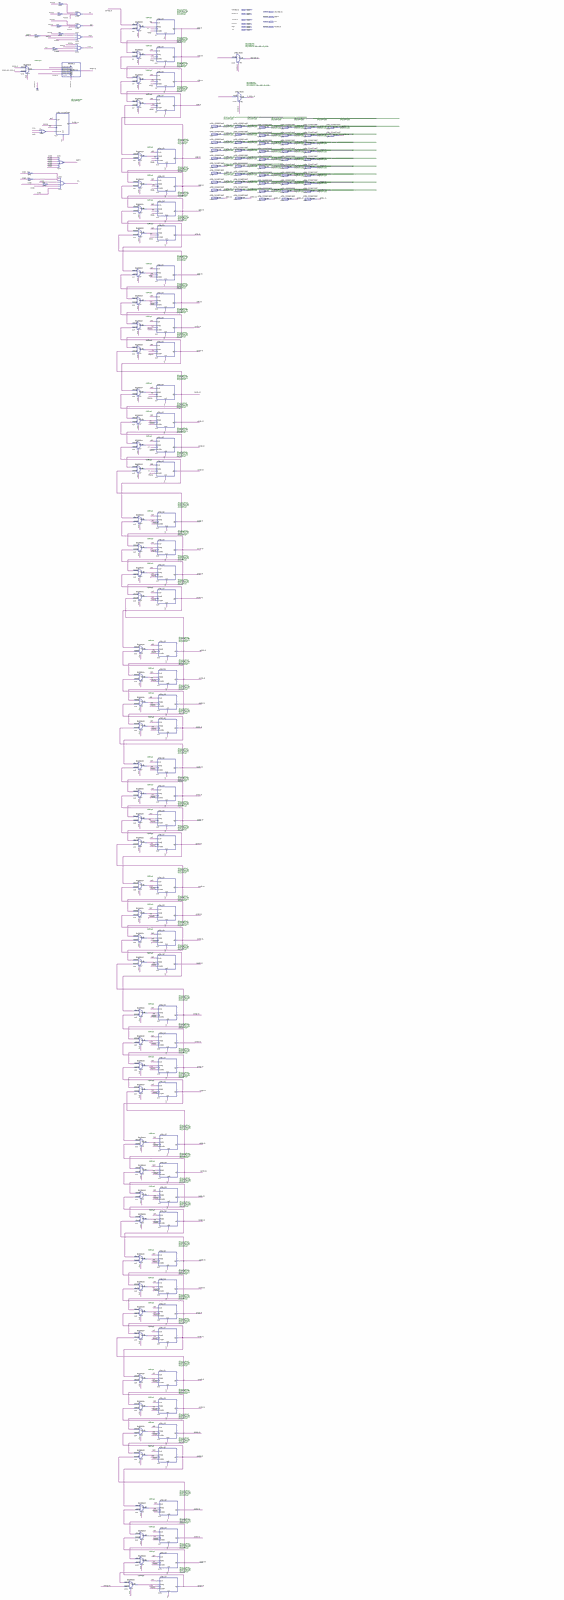
[diagram p0: schematic sheet, whole]
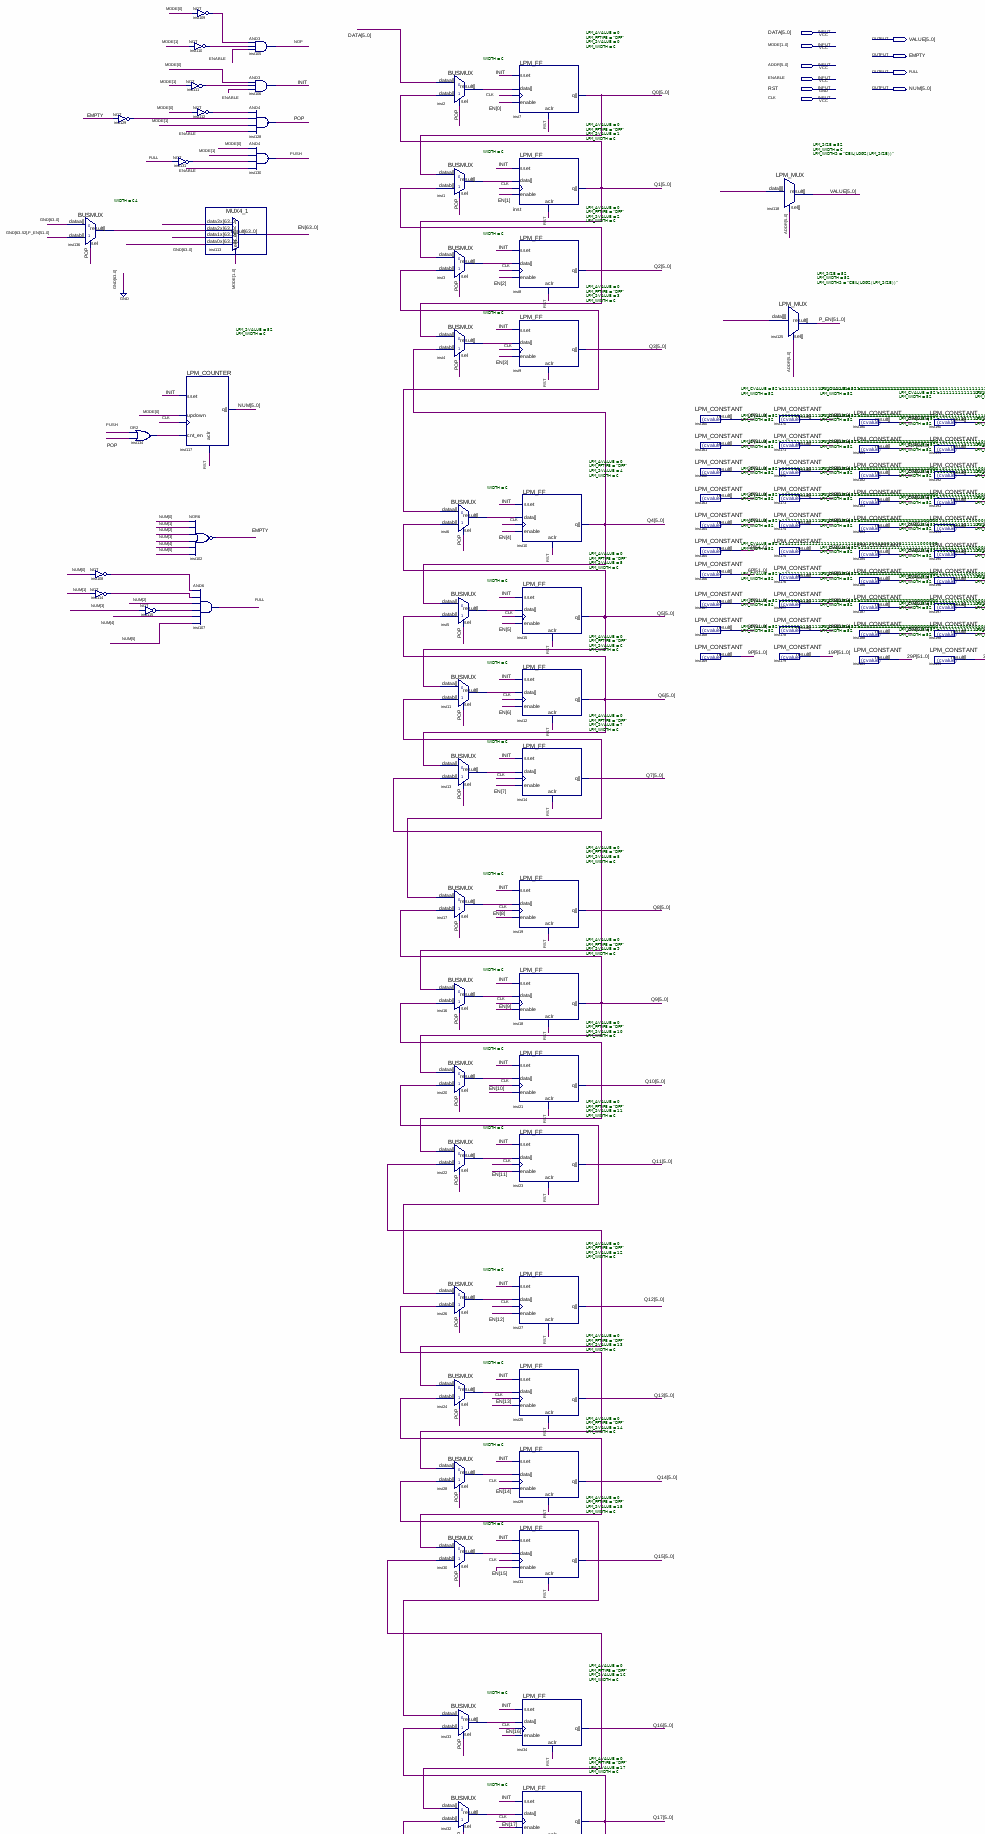
[diagram p1: schematic sheet, upper left part]
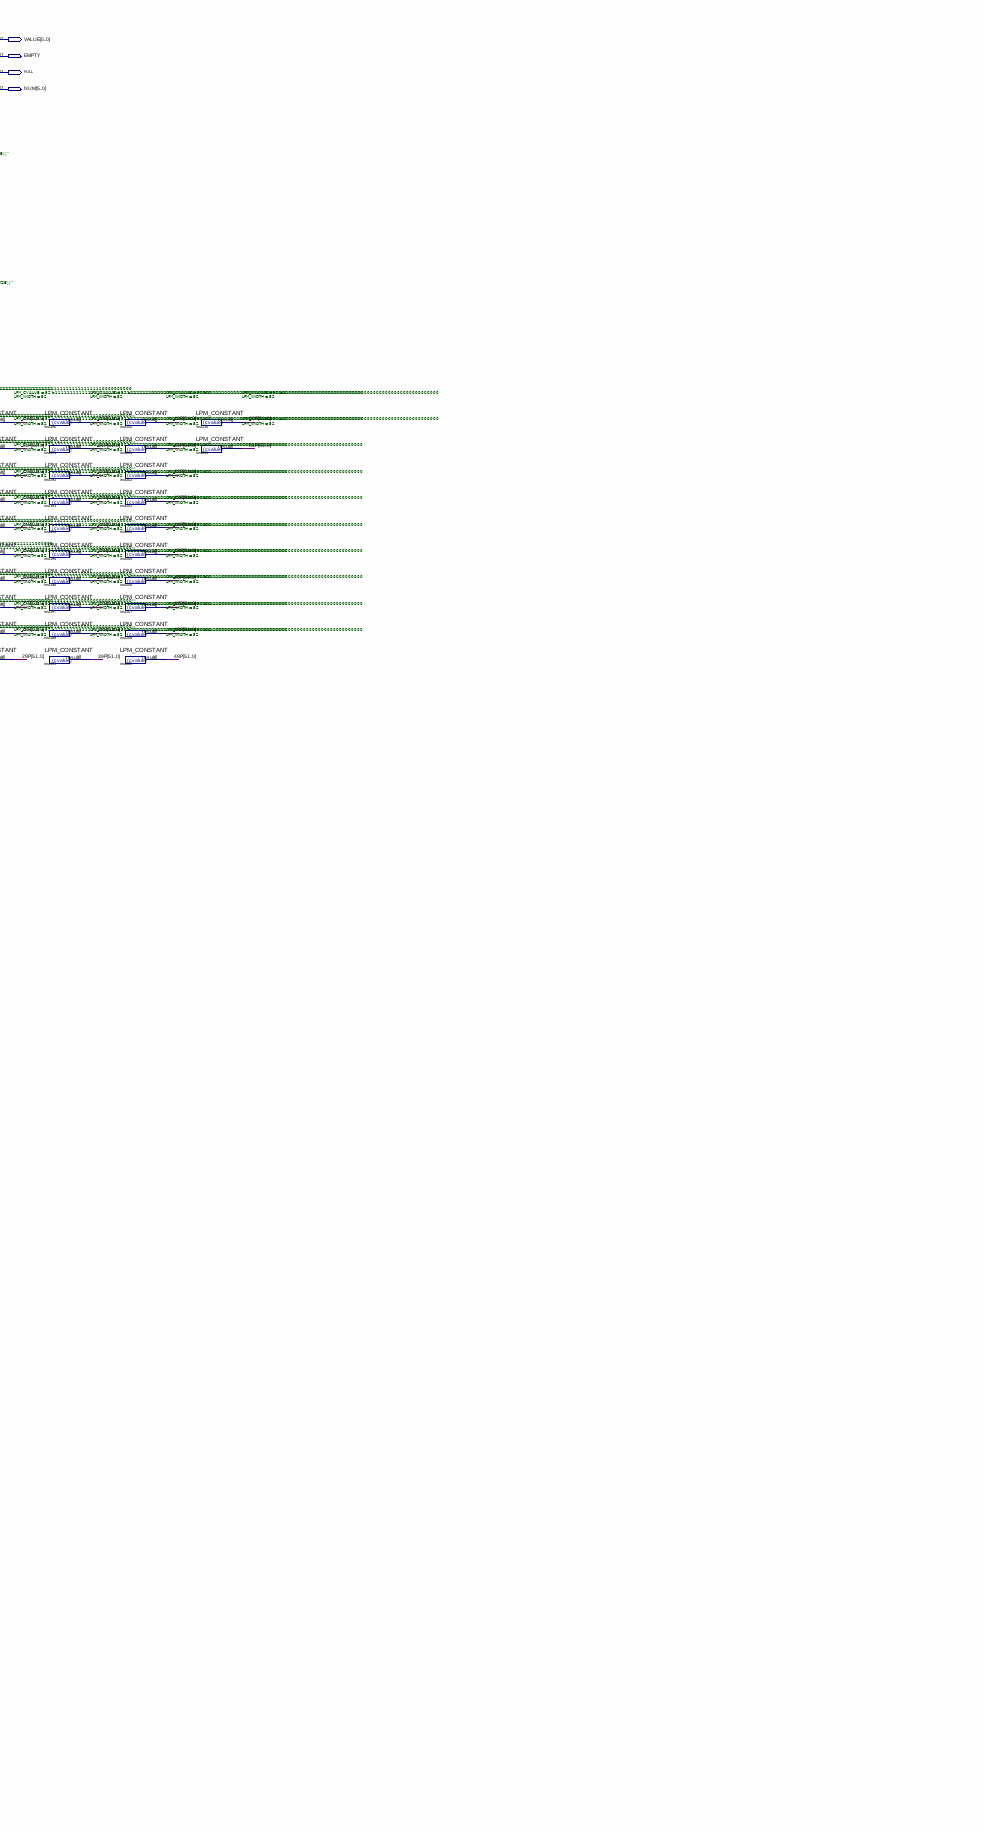
[diagram p2: schematic sheet, upper right part]
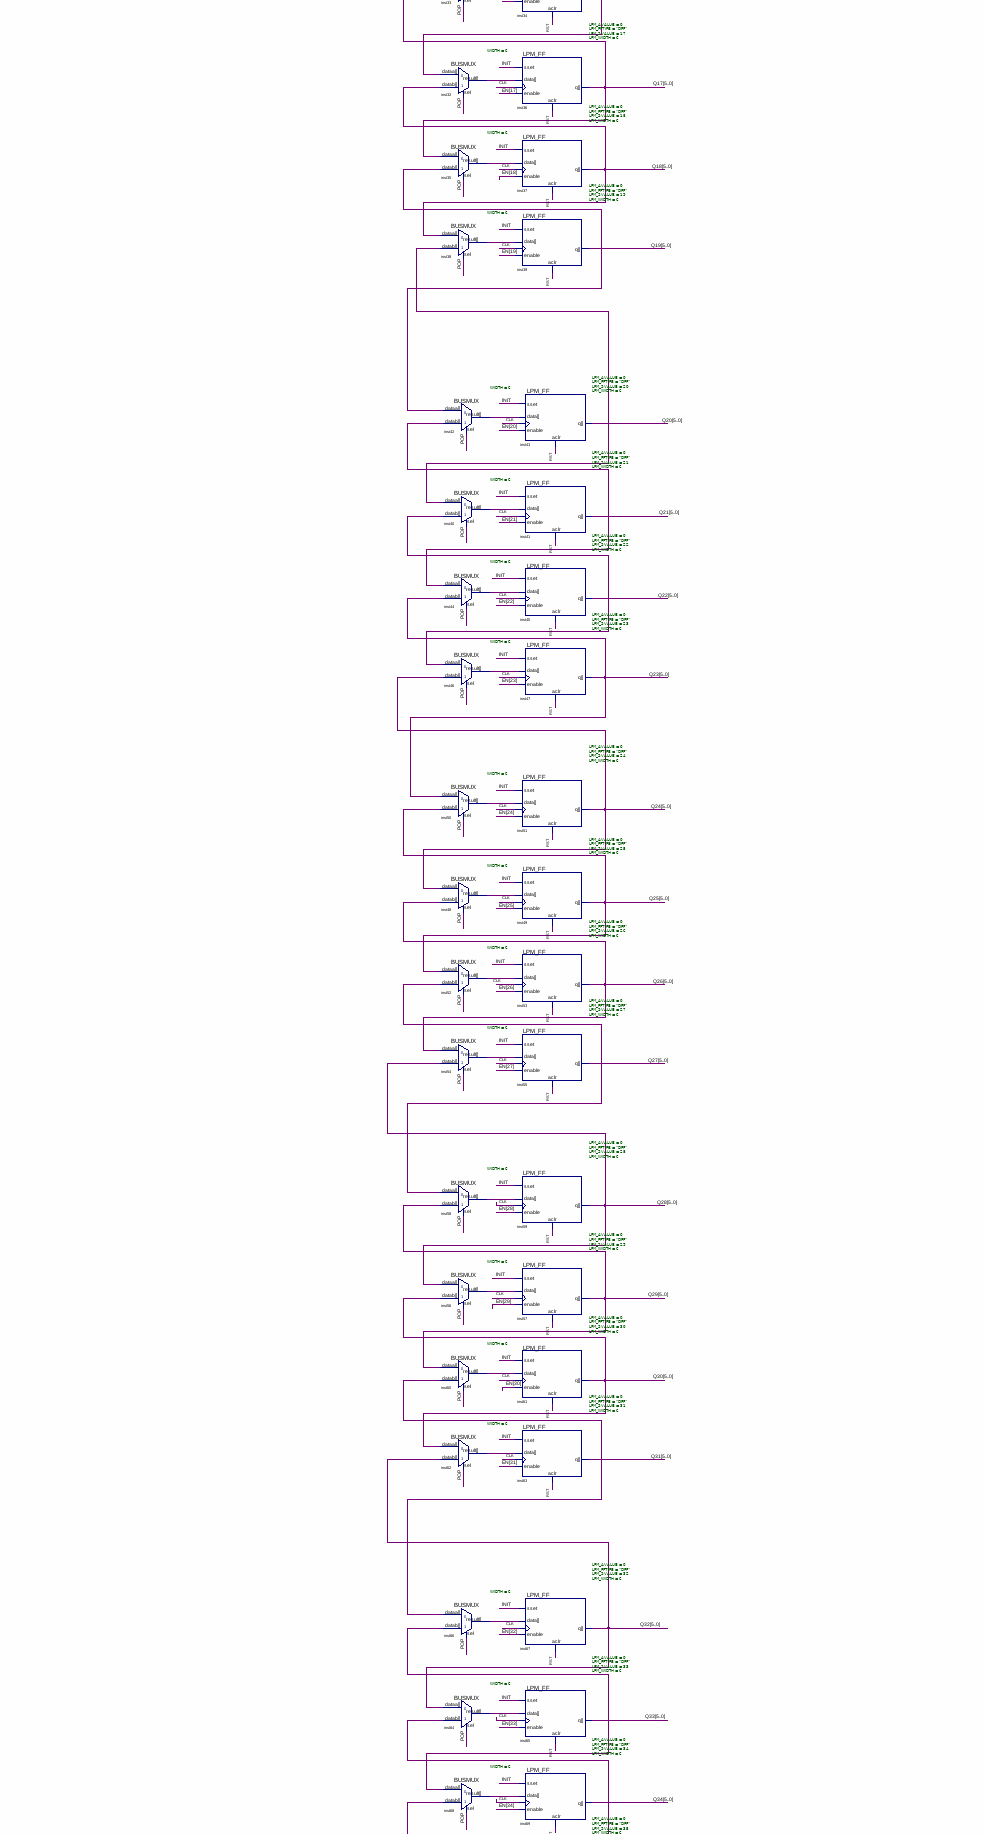
[diagram p3: schematic sheet, middle left part]
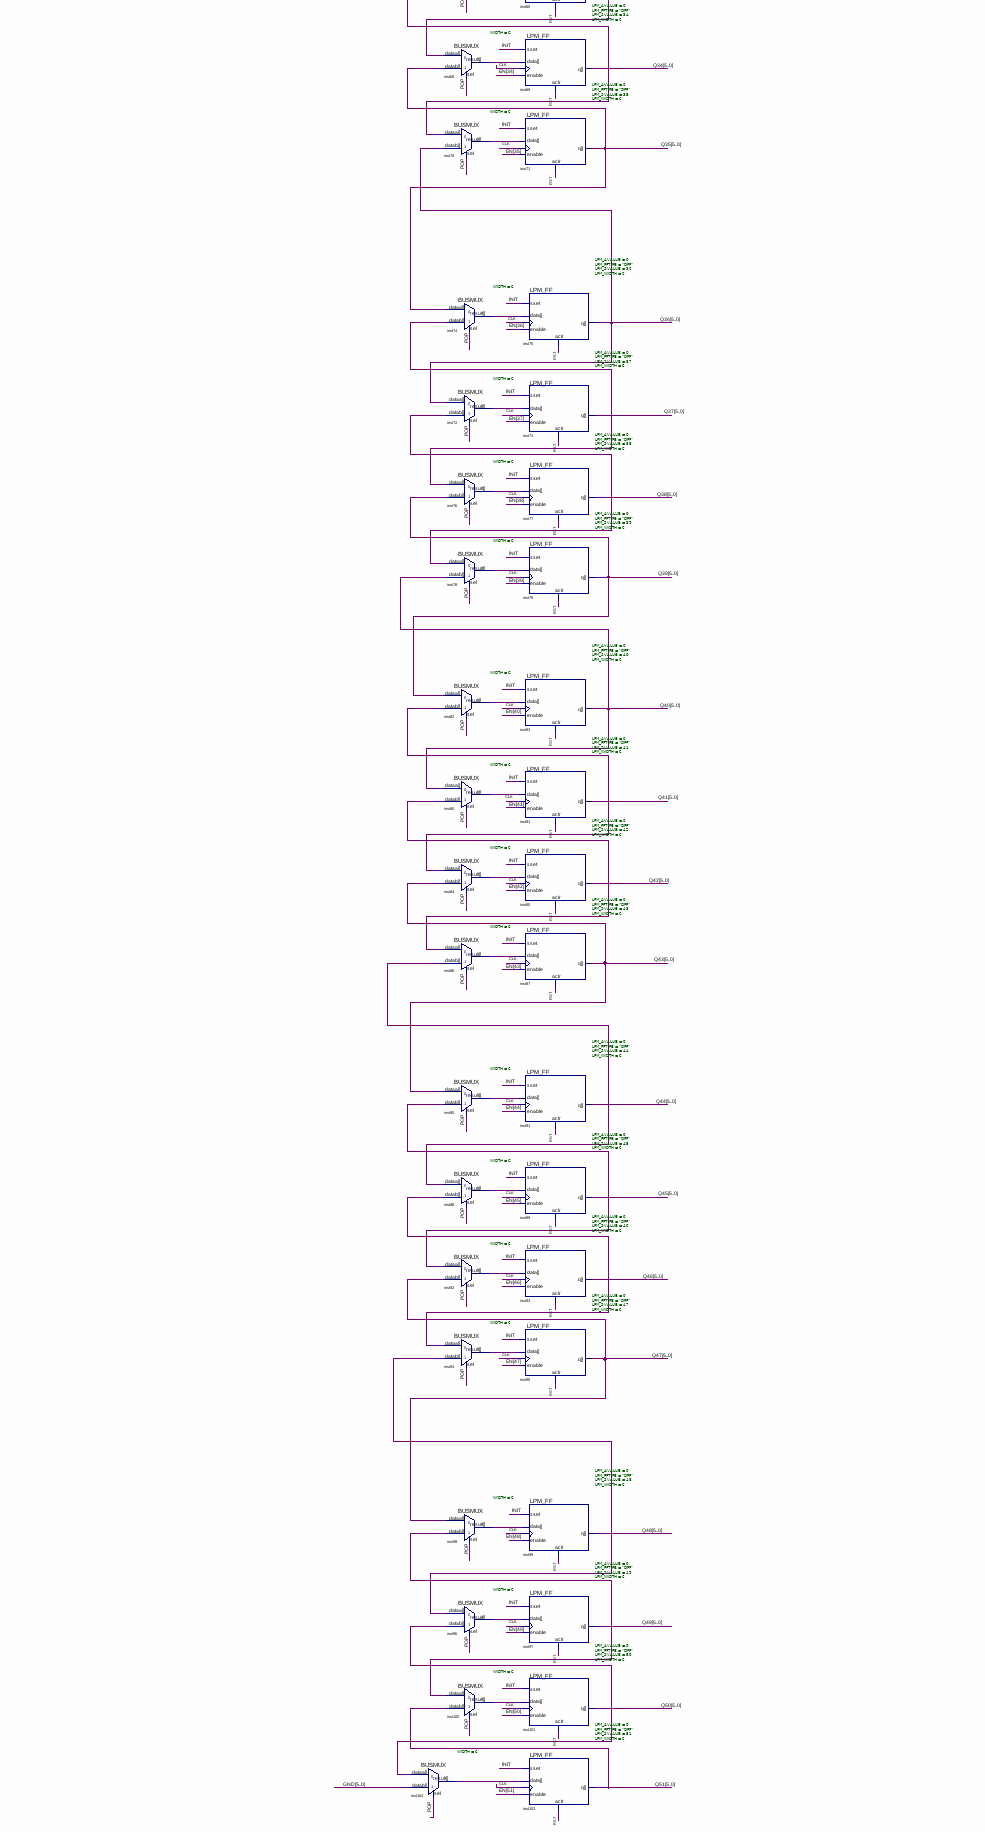
[diagram p4: schematic sheet, lower left part]
// Quartus schematic g09_stack52.bdf as structural Verilog: 177 symbols, 10 pins
module g09_stack52 (
  input  [5:0] DATA,
  input  [1:0] MODE,
  input  [5:0] ADDR,
  input  ENABLE,
  input  RST,
  input  CLK,
  output [5:0] VALUE,
  output EMPTY,
  output FULL,
  output [5:0] NUM
);

  wire INIT, inst108_out, inst109_out, inst110_out, inst111_out, inst112_out, inst114_out, inst115_out,
       inst129_out, inst131_out, inst134_out, NOP, POP, PUSH;
  wire [5:0] inst1_result, inst2_result, inst3_result, inst4_result, inst5_result, inst6_result,
       inst11_result, inst13_result, inst16_result, inst17_result, inst20_result, inst22_result,
       inst24_result, inst26_result, inst28_result, inst30_result, inst32_result, inst33_result,
       inst35_result, inst38_result, inst40_result, inst42_result, inst44_result, inst46_result,
       inst48_result, inst50_result, inst52_result, inst54_result, inst56_result, inst58_result,
       inst60_result, inst62_result, inst64_result, inst66_result, inst68_result, inst70_result,
       inst72_result, inst74_result, inst76_result, inst78_result, inst80_result, inst82_result,
       inst84_result, inst86_result, inst88_result, inst90_result, inst92_result, inst94_result,
       inst96_result, inst98_result, inst100_result, inst104_result, Q0, Q1, Q2, Q3, Q4, Q5, Q6, Q7, Q8, Q9,
       Q10, Q11, Q12, Q13, Q14, Q15, Q16, Q17, Q18, Q19, Q20, Q21, Q22, Q23, Q24, Q25, Q26, Q27, Q28, Q29,
       Q30, Q31, Q32, Q33, Q34, Q35, Q36, Q37, Q38, Q39, Q40, Q41, Q42, Q43, Q44, Q45, Q46, Q47, Q48, Q49,
       Q50, Q51;
  wire [51:0] \0P , \1P , \2P , \3P , \4P , \5P , \6P , \7P , \8P , \9P , \10P , \11P , \12P , \13P , \14P ,
       \15P , \16P , \17P , \18P , \19P , \20P , \21P , \22P , \23P , \24P , \25P , \26P , \27P , \28P ,
       \29P , \30P , \31P , \32P , \33P , \34P , \35P , \36P , \37P , \38P , \39P , \40P , \41P , \42P ,
       \43P , \44P , \45P , \46P , \47P , \48P , \49P , \50P , \51P , P_EN;
  wire [63:0] EN, inst136_result;

  BUSMUX #(.WIDTH(64)) inst136 (.datab({{12{1'b0}}, P_EN}), .sel(POP), .dataa({64{1'b0}}), .result(inst136_result));
  not inst108 (inst108_out, NUM[0]);
  not inst114 (inst114_out, NUM[1]);
  not inst129 (inst129_out, EMPTY);
  or inst134 (inst134_out, PUSH, POP);
  not inst115 (inst115_out, NUM[3]);
  not inst131 (inst131_out, FULL);
  not inst109 (inst109_out, MODE[0]);
  not inst110 (inst110_out, MODE[1]);
  not inst111 (inst111_out, MODE[1]);
  not inst112 (inst112_out, MODE[0]);
  LPM_COUNTER #(.LPM_SVALUE(52), .LPM_WIDTH(6)) inst117 (
    .aclr(RST), .clock(CLK), .cnt_en(inst134_out), .sset(INIT), .updown(MODE[0]), .q(NUM));
  nor inst102 (EMPTY, NUM[0], NUM[1], NUM[2], NUM[3], NUM[4], NUM[5]);
  and inst107 (FULL, inst108_out, inst114_out, NUM[2], inst115_out, NUM[4], NUM[5]);
  MUX4_1 inst113 (
    .data3x({{12{1'b0}}, {52{PUSH}}}), .data2x(inst136_result), .data1x({{12{1'b0}}, {52{INIT}}}),
    .data0x({64{1'b0}}), .sel(MODE), .result(EN));
  and inst105 (NOP, inst109_out, inst110_out, ENABLE);
  and inst106 (INIT, MODE[0], inst111_out, ENABLE);
  and inst128 (POP, inst112_out, inst129_out, MODE[1], ENABLE);
  and inst130 (PUSH, MODE[0], MODE[1], inst131_out, ENABLE);
  BUSMUX #(.WIDTH(6)) inst104 (.datab({6{1'b0}}), .sel(POP), .dataa(Q50), .result(inst104_result));
  BUSMUX #(.WIDTH(6)) inst2 (.datab(Q1), .sel(POP), .dataa(DATA), .result(inst2_result));
  BUSMUX #(.WIDTH(6)) inst1 (.datab(Q2), .sel(POP), .dataa(Q0), .result(inst1_result));
  BUSMUX #(.WIDTH(6)) inst3 (.datab(Q3), .sel(POP), .dataa(Q1), .result(inst3_result));
  BUSMUX #(.WIDTH(6)) inst4 (.datab(Q4), .sel(POP), .dataa(Q2), .result(inst4_result));
  BUSMUX #(.WIDTH(6)) inst6 (.datab(Q5), .sel(POP), .dataa(Q3), .result(inst6_result));
  BUSMUX #(.WIDTH(6)) inst5 (.datab(Q6), .sel(POP), .dataa(Q4), .result(inst5_result));
  BUSMUX #(.WIDTH(6)) inst11 (.datab(Q7), .sel(POP), .dataa(Q5), .result(inst11_result));
  BUSMUX #(.WIDTH(6)) inst13 (.datab(Q8), .sel(POP), .dataa(Q6), .result(inst13_result));
  BUSMUX #(.WIDTH(6)) inst17 (.datab(Q9), .sel(POP), .dataa(Q7), .result(inst17_result));
  BUSMUX #(.WIDTH(6)) inst16 (.datab(Q10), .sel(POP), .dataa(Q8), .result(inst16_result));
  BUSMUX #(.WIDTH(6)) inst20 (.datab(Q11), .sel(POP), .dataa(Q9), .result(inst20_result));
  BUSMUX #(.WIDTH(6)) inst22 (.datab(Q12), .sel(POP), .dataa(Q10), .result(inst22_result));
  BUSMUX #(.WIDTH(6)) inst26 (.datab(Q13), .sel(POP), .dataa(Q11), .result(inst26_result));
  BUSMUX #(.WIDTH(6)) inst24 (.datab(Q14), .sel(POP), .dataa(Q12), .result(inst24_result));
  BUSMUX #(.WIDTH(6)) inst28 (.datab(Q15), .sel(POP), .dataa(Q13), .result(inst28_result));
  BUSMUX #(.WIDTH(6)) inst30 (.datab(Q16), .sel(POP), .dataa(Q14), .result(inst30_result));
  BUSMUX #(.WIDTH(6)) inst33 (.datab(Q17), .sel(POP), .dataa(Q15), .result(inst33_result));
  BUSMUX #(.WIDTH(6)) inst32 (.datab(Q18), .sel(POP), .dataa(Q16), .result(inst32_result));
  BUSMUX #(.WIDTH(6)) inst35 (.datab(Q19), .sel(POP), .dataa(Q17), .result(inst35_result));
  BUSMUX #(.WIDTH(6)) inst38 (.datab(Q20), .sel(POP), .dataa(Q18), .result(inst38_result));
  BUSMUX #(.WIDTH(6)) inst50 (.datab(Q25), .sel(POP), .dataa(Q23), .result(inst50_result));
  BUSMUX #(.WIDTH(6)) inst48 (.datab(Q26), .sel(POP), .dataa(Q24), .result(inst48_result));
  BUSMUX #(.WIDTH(6)) inst52 (.datab(Q27), .sel(POP), .dataa(Q25), .result(inst52_result));
  BUSMUX #(.WIDTH(6)) inst54 (.datab(Q28), .sel(POP), .dataa(Q26), .result(inst54_result));
  BUSMUX #(.WIDTH(6)) inst58 (.datab(Q29), .sel(POP), .dataa(Q27), .result(inst58_result));
  BUSMUX #(.WIDTH(6)) inst56 (.datab(Q30), .sel(POP), .dataa(Q28), .result(inst56_result));
  BUSMUX #(.WIDTH(6)) inst60 (.datab(Q31), .sel(POP), .dataa(Q29), .result(inst60_result));
  BUSMUX #(.WIDTH(6)) inst62 (.datab(Q32), .sel(POP), .dataa(Q30), .result(inst62_result));
  BUSMUX #(.WIDTH(6)) inst42 (.datab(Q21), .sel(POP), .dataa(Q19), .result(inst42_result));
  BUSMUX #(.WIDTH(6)) inst40 (.datab(Q22), .sel(POP), .dataa(Q20), .result(inst40_result));
  BUSMUX #(.WIDTH(6)) inst44 (.datab(Q23), .sel(POP), .dataa(Q21), .result(inst44_result));
  BUSMUX #(.WIDTH(6)) inst46 (.datab(Q24), .sel(POP), .dataa(Q22), .result(inst46_result));
  BUSMUX #(.WIDTH(6)) inst66 (.datab(Q33), .sel(POP), .dataa(Q31), .result(inst66_result));
  BUSMUX #(.WIDTH(6)) inst64 (.datab(Q34), .sel(POP), .dataa(Q32), .result(inst64_result));
  BUSMUX #(.WIDTH(6)) inst68 (.datab(Q35), .sel(POP), .dataa(Q33), .result(inst68_result));
  BUSMUX #(.WIDTH(6)) inst70 (.datab(Q36), .sel(POP), .dataa(Q34), .result(inst70_result));
  BUSMUX #(.WIDTH(6)) inst74 (.datab(Q37), .sel(POP), .dataa(Q35), .result(inst74_result));
  BUSMUX #(.WIDTH(6)) inst72 (.datab(Q38), .sel(POP), .dataa(Q36), .result(inst72_result));
  BUSMUX #(.WIDTH(6)) inst76 (.datab(Q39), .sel(POP), .dataa(Q37), .result(inst76_result));
  BUSMUX #(.WIDTH(6)) inst78 (.datab(Q40), .sel(POP), .dataa(Q38), .result(inst78_result));
  BUSMUX #(.WIDTH(6)) inst82 (.datab(Q41), .sel(POP), .dataa(Q39), .result(inst82_result));
  BUSMUX #(.WIDTH(6)) inst80 (.datab(Q42), .sel(POP), .dataa(Q40), .result(inst80_result));
  BUSMUX #(.WIDTH(6)) inst84 (.datab(Q43), .sel(POP), .dataa(Q41), .result(inst84_result));
  BUSMUX #(.WIDTH(6)) inst86 (.datab(Q44), .sel(POP), .dataa(Q42), .result(inst86_result));
  BUSMUX #(.WIDTH(6)) inst90 (.datab(Q45), .sel(POP), .dataa(Q43), .result(inst90_result));
  BUSMUX #(.WIDTH(6)) inst88 (.datab(Q46), .sel(POP), .dataa(Q44), .result(inst88_result));
  BUSMUX #(.WIDTH(6)) inst92 (.datab(Q47), .sel(POP), .dataa(Q45), .result(inst92_result));
  BUSMUX #(.WIDTH(6)) inst94 (.datab(Q48), .sel(POP), .dataa(Q46), .result(inst94_result));
  BUSMUX #(.WIDTH(6)) inst98 (.datab(Q49), .sel(POP), .dataa(Q47), .result(inst98_result));
  BUSMUX #(.WIDTH(6)) inst96 (.datab(Q50), .sel(POP), .dataa(Q48), .result(inst96_result));
  BUSMUX #(.WIDTH(6)) inst100 (.datab(Q51), .sel(POP), .dataa(Q49), .result(inst100_result));
  LPM_FF #(.LPM_AVALUE(0), .LPM_FFTYPE("DFF"), .LPM_SVALUE(0), .LPM_WIDTH(6)) inst7 (
    .aclr(RST), .clock(CLK), .data(inst2_result), .enable(EN[0]), .sset(INIT), .q(Q0));
  LPM_FF #(.LPM_AVALUE(0), .LPM_FFTYPE("DFF"), .LPM_SVALUE(1), .LPM_WIDTH(6)) inst (
    .aclr(RST), .clock(CLK), .data(inst1_result), .enable(EN[1]), .sset(INIT), .q(Q1));
  LPM_FF #(.LPM_AVALUE(0), .LPM_FFTYPE("DFF"), .LPM_SVALUE(2), .LPM_WIDTH(6)) inst8 (
    .aclr(RST), .clock(CLK), .data(inst3_result), .enable(EN[2]), .sset(INIT), .q(Q2));
  LPM_FF #(.LPM_AVALUE(0), .LPM_FFTYPE("DFF"), .LPM_SVALUE(3), .LPM_WIDTH(6)) inst9 (
    .aclr(RST), .clock(CLK), .data(inst4_result), .enable(EN[3]), .sset(INIT), .q(Q3));
  LPM_FF #(.LPM_AVALUE(0), .LPM_FFTYPE("DFF"), .LPM_SVALUE(4), .LPM_WIDTH(6)) inst10 (
    .aclr(RST), .clock(CLK), .data(inst6_result), .enable(EN[4]), .sset(INIT), .q(Q4));
  LPM_FF #(.LPM_AVALUE(0), .LPM_FFTYPE("DFF"), .LPM_SVALUE(5), .LPM_WIDTH(6)) inst15 (
    .aclr(RST), .clock(CLK), .data(inst5_result), .enable(EN[5]), .sset(INIT), .q(Q5));
  LPM_FF #(.LPM_AVALUE(0), .LPM_FFTYPE("DFF"), .LPM_SVALUE(6), .LPM_WIDTH(6)) inst12 (
    .aclr(RST), .clock(CLK), .data(inst11_result), .enable(EN[6]), .sset(INIT), .q(Q6));
  LPM_FF #(.LPM_AVALUE(0), .LPM_FFTYPE("DFF"), .LPM_SVALUE(7), .LPM_WIDTH(6)) inst14 (
    .aclr(RST), .clock(CLK), .data(inst13_result), .enable(EN[7]), .sset(INIT), .q(Q7));
  LPM_FF #(.LPM_AVALUE(0), .LPM_FFTYPE("DFF"), .LPM_SVALUE(8), .LPM_WIDTH(6)) inst19 (
    .aclr(RST), .clock(CLK), .data(inst17_result), .enable(EN[8]), .sset(INIT), .q(Q8));
  LPM_FF #(.LPM_AVALUE(0), .LPM_FFTYPE("DFF"), .LPM_SVALUE(9), .LPM_WIDTH(6)) inst18 (
    .aclr(RST), .clock(CLK), .data(inst16_result), .enable(EN[9]), .sset(INIT), .q(Q9));
  LPM_FF #(.LPM_AVALUE(0), .LPM_FFTYPE("DFF"), .LPM_SVALUE(10), .LPM_WIDTH(6)) inst21 (
    .aclr(RST), .clock(CLK), .data(inst20_result), .enable(EN[10]), .sset(INIT), .q(Q10));
  LPM_FF #(.LPM_AVALUE(0), .LPM_FFTYPE("DFF"), .LPM_SVALUE(11), .LPM_WIDTH(6)) inst23 (
    .aclr(RST), .clock(CLK), .data(inst22_result), .enable(EN[11]), .sset(INIT), .q(Q11));
  LPM_FF #(.LPM_AVALUE(0), .LPM_FFTYPE("DFF"), .LPM_SVALUE(12), .LPM_WIDTH(6)) inst27 (
    .aclr(RST), .clock(CLK), .data(inst26_result), .enable(EN[12]), .sset(INIT), .q(Q12));
  LPM_FF #(.LPM_AVALUE(0), .LPM_FFTYPE("DFF"), .LPM_SVALUE(13), .LPM_WIDTH(6)) inst25 (
    .aclr(RST), .clock(CLK), .data(inst24_result), .enable(EN[13]), .sset(INIT), .q(Q13));
  LPM_FF #(.LPM_AVALUE(0), .LPM_FFTYPE("DFF"), .LPM_SVALUE(14), .LPM_WIDTH(6)) inst29 (
    .aclr(RST), .clock(CLK), .data(inst28_result), .enable(EN[14]), .sset(INIT), .q(Q14));
  LPM_FF #(.LPM_AVALUE(0), .LPM_FFTYPE("DFF"), .LPM_SVALUE(15), .LPM_WIDTH(6)) inst31 (
    .aclr(RST), .clock(CLK), .data(inst30_result), .enable(EN[15]), .sset(INIT), .q(Q15));
  LPM_FF #(.LPM_AVALUE(0), .LPM_FFTYPE("DFF"), .LPM_SVALUE(16), .LPM_WIDTH(6)) inst34 (
    .aclr(RST), .clock(CLK), .data(inst33_result), .enable(EN[16]), .sset(INIT), .q(Q16));
  LPM_FF #(.LPM_AVALUE(0), .LPM_FFTYPE("DFF"), .LPM_SVALUE(17), .LPM_WIDTH(6)) inst36 (
    .aclr(RST), .clock(CLK), .data(inst32_result), .enable(EN[17]), .sset(INIT), .q(Q17));
  LPM_FF #(.LPM_AVALUE(0), .LPM_FFTYPE("DFF"), .LPM_SVALUE(18), .LPM_WIDTH(6)) inst37 (
    .aclr(RST), .clock(CLK), .data(inst35_result), .enable(EN[18]), .sset(INIT), .q(Q18));
  LPM_FF #(.LPM_AVALUE(0), .LPM_FFTYPE("DFF"), .LPM_SVALUE(19), .LPM_WIDTH(6)) inst39 (
    .aclr(RST), .clock(CLK), .data(inst38_result), .enable(EN[19]), .sset(INIT), .q(Q19));
  LPM_FF #(.LPM_AVALUE(0), .LPM_FFTYPE("DFF"), .LPM_SVALUE(20), .LPM_WIDTH(6)) inst43 (
    .aclr(RST), .clock(CLK), .data(inst42_result), .enable(EN[20]), .sset(INIT), .q(Q20));
  LPM_FF #(.LPM_AVALUE(0), .LPM_FFTYPE("DFF"), .LPM_SVALUE(21), .LPM_WIDTH(6)) inst41 (
    .aclr(RST), .clock(CLK), .data(inst40_result), .enable(EN[21]), .sset(INIT), .q(Q21));
  LPM_FF #(.LPM_AVALUE(0), .LPM_FFTYPE("DFF"), .LPM_SVALUE(22), .LPM_WIDTH(6)) inst45 (
    .aclr(RST), .clock(CLK), .data(inst44_result), .enable(EN[22]), .sset(INIT), .q(Q22));
  LPM_FF #(.LPM_AVALUE(0), .LPM_FFTYPE("DFF"), .LPM_SVALUE(23), .LPM_WIDTH(6)) inst47 (
    .aclr(RST), .clock(CLK), .data(inst46_result), .enable(EN[23]), .sset(INIT), .q(Q23));
  LPM_FF #(.LPM_AVALUE(0), .LPM_FFTYPE("DFF"), .LPM_SVALUE(24), .LPM_WIDTH(6)) inst51 (
    .aclr(RST), .clock(CLK), .data(inst50_result), .enable(EN[24]), .sset(INIT), .q(Q24));
  LPM_FF #(.LPM_AVALUE(0), .LPM_FFTYPE("DFF"), .LPM_SVALUE(25), .LPM_WIDTH(6)) inst49 (
    .aclr(RST), .clock(CLK), .data(inst48_result), .enable(EN[25]), .sset(INIT), .q(Q25));
  LPM_FF #(.LPM_AVALUE(0), .LPM_FFTYPE("DFF"), .LPM_SVALUE(26), .LPM_WIDTH(6)) inst53 (
    .aclr(RST), .clock(CLK), .data(inst52_result), .enable(EN[26]), .sset(INIT), .q(Q26));
  LPM_FF #(.LPM_AVALUE(0), .LPM_FFTYPE("DFF"), .LPM_SVALUE(27), .LPM_WIDTH(6)) inst55 (
    .aclr(RST), .clock(CLK), .data(inst54_result), .enable(EN[27]), .sset(INIT), .q(Q27));
  LPM_FF #(.LPM_AVALUE(0), .LPM_FFTYPE("DFF"), .LPM_SVALUE(28), .LPM_WIDTH(6)) inst59 (
    .aclr(RST), .clock(CLK), .data(inst58_result), .enable(EN[28]), .sset(INIT), .q(Q28));
  LPM_FF #(.LPM_AVALUE(0), .LPM_FFTYPE("DFF"), .LPM_SVALUE(29), .LPM_WIDTH(6)) inst57 (
    .aclr(RST), .clock(CLK), .data(inst56_result), .enable(EN[29]), .sset(INIT), .q(Q29));
  LPM_FF #(.LPM_AVALUE(0), .LPM_FFTYPE("DFF"), .LPM_SVALUE(30), .LPM_WIDTH(6)) inst61 (
    .aclr(RST), .clock(CLK), .data(inst60_result), .enable(EN[30]), .sset(INIT), .q(Q30));
  LPM_FF #(.LPM_AVALUE(0), .LPM_FFTYPE("DFF"), .LPM_SVALUE(31), .LPM_WIDTH(6)) inst63 (
    .aclr(RST), .clock(CLK), .data(inst62_result), .enable(EN[31]), .sset(INIT), .q(Q31));
  LPM_FF #(.LPM_AVALUE(0), .LPM_FFTYPE("DFF"), .LPM_SVALUE(32), .LPM_WIDTH(6)) inst67 (
    .aclr(RST), .clock(CLK), .data(inst66_result), .enable(EN[32]), .sset(INIT), .q(Q32));
  LPM_FF #(.LPM_AVALUE(0), .LPM_FFTYPE("DFF"), .LPM_SVALUE(33), .LPM_WIDTH(6)) inst65 (
    .aclr(RST), .clock(CLK), .data(inst64_result), .enable(EN[33]), .sset(INIT), .q(Q33));
  LPM_FF #(.LPM_AVALUE(0), .LPM_FFTYPE("DFF"), .LPM_SVALUE(34), .LPM_WIDTH(6)) inst69 (
    .aclr(RST), .clock(CLK), .data(inst68_result), .enable(EN[34]), .sset(INIT), .q(Q34));
  LPM_FF #(.LPM_AVALUE(0), .LPM_FFTYPE("DFF"), .LPM_SVALUE(35), .LPM_WIDTH(6)) inst71 (
    .aclr(RST), .clock(CLK), .data(inst70_result), .enable(EN[35]), .sset(INIT), .q(Q35));
  LPM_FF #(.LPM_AVALUE(0), .LPM_FFTYPE("DFF"), .LPM_SVALUE(40), .LPM_WIDTH(6)) inst83 (
    .aclr(RST), .clock(CLK), .data(inst82_result), .enable(EN[40]), .sset(INIT), .q(Q40));
  LPM_FF #(.LPM_AVALUE(0), .LPM_FFTYPE("DFF"), .LPM_SVALUE(41), .LPM_WIDTH(6)) inst81 (
    .aclr(RST), .clock(CLK), .data(inst80_result), .enable(EN[41]), .sset(INIT), .q(Q41));
  LPM_FF #(.LPM_AVALUE(0), .LPM_FFTYPE("DFF"), .LPM_SVALUE(42), .LPM_WIDTH(6)) inst85 (
    .aclr(RST), .clock(CLK), .data(inst84_result), .enable(EN[42]), .sset(INIT), .q(Q42));
  LPM_FF #(.LPM_AVALUE(0), .LPM_FFTYPE("DFF"), .LPM_SVALUE(43), .LPM_WIDTH(6)) inst87 (
    .aclr(RST), .clock(CLK), .data(inst86_result), .enable(EN[43]), .sset(INIT), .q(Q43));
  LPM_FF #(.LPM_AVALUE(0), .LPM_FFTYPE("DFF"), .LPM_SVALUE(44), .LPM_WIDTH(6)) inst91 (
    .aclr(RST), .clock(CLK), .data(inst90_result), .enable(EN[44]), .sset(INIT), .q(Q44));
  LPM_FF #(.LPM_AVALUE(0), .LPM_FFTYPE("DFF"), .LPM_SVALUE(45), .LPM_WIDTH(6)) inst89 (
    .aclr(RST), .clock(CLK), .data(inst88_result), .enable(EN[45]), .sset(INIT), .q(Q45));
  LPM_FF #(.LPM_AVALUE(0), .LPM_FFTYPE("DFF"), .LPM_SVALUE(46), .LPM_WIDTH(6)) inst93 (
    .aclr(RST), .clock(CLK), .data(inst92_result), .enable(EN[46]), .sset(INIT), .q(Q46));
  LPM_FF #(.LPM_AVALUE(0), .LPM_FFTYPE("DFF"), .LPM_SVALUE(47), .LPM_WIDTH(6)) inst95 (
    .aclr(RST), .clock(CLK), .data(inst94_result), .enable(EN[47]), .sset(INIT), .q(Q47));
  LPM_FF #(.LPM_AVALUE(0), .LPM_FFTYPE("DFF"), .LPM_SVALUE(36), .LPM_WIDTH(6)) inst75 (
    .aclr(RST), .clock(CLK), .data(inst74_result), .enable(EN[36]), .sset(INIT), .q(Q36));
  LPM_FF #(.LPM_AVALUE(0), .LPM_FFTYPE("DFF"), .LPM_SVALUE(37), .LPM_WIDTH(6)) inst73 (
    .aclr(RST), .clock(CLK), .data(inst72_result), .enable(EN[37]), .sset(INIT), .q(Q37));
  LPM_FF #(.LPM_AVALUE(0), .LPM_FFTYPE("DFF"), .LPM_SVALUE(38), .LPM_WIDTH(6)) inst77 (
    .aclr(RST), .clock(CLK), .data(inst76_result), .enable(EN[38]), .sset(INIT), .q(Q38));
  LPM_FF #(.LPM_AVALUE(0), .LPM_FFTYPE("DFF"), .LPM_SVALUE(39), .LPM_WIDTH(6)) inst79 (
    .aclr(RST), .clock(CLK), .data(inst78_result), .enable(EN[39]), .sset(INIT), .q(Q39));
  LPM_FF #(.LPM_AVALUE(0), .LPM_FFTYPE("DFF"), .LPM_SVALUE(48), .LPM_WIDTH(6)) inst99 (
    .aclr(RST), .clock(CLK), .data(inst98_result), .enable(EN[48]), .sset(INIT), .q(Q48));
  LPM_FF #(.LPM_AVALUE(0), .LPM_FFTYPE("DFF"), .LPM_SVALUE(49), .LPM_WIDTH(6)) inst97 (
    .aclr(RST), .clock(CLK), .data(inst96_result), .enable(EN[49]), .sset(INIT), .q(Q49));
  LPM_FF #(.LPM_AVALUE(0), .LPM_FFTYPE("DFF"), .LPM_SVALUE(50), .LPM_WIDTH(6)) inst101 (
    .aclr(RST), .clock(CLK), .data(inst100_result), .enable(EN[50]), .sset(INIT), .q(Q50));
  LPM_FF #(.LPM_AVALUE(0), .LPM_FFTYPE("DFF"), .LPM_SVALUE(51), .LPM_WIDTH(6)) inst103 (
    .aclr(RST), .clock(CLK), .data(inst104_result), .enable(EN[51]), .sset(INIT), .q(Q51));
  LPM_CONSTANT #(.LPM_CVALUE(52'b1111111111111111111111111111111111111111111111111111), .LPM_WIDTH(52)) inst160 (.result(\0P ));
  LPM_CONSTANT #(.LPM_CVALUE(52'b1111111111111111111111111111111111111111111111111110), .LPM_WIDTH(52)) inst161 (.result(\1P ));
  LPM_CONSTANT #(.LPM_CVALUE(52'b1111111111111111111111111111111111111111111111111100), .LPM_WIDTH(52)) inst162 (.result(\2P ));
  LPM_CONSTANT #(.LPM_CVALUE(52'b1111111111111111111111111111111111111111111111111000), .LPM_WIDTH(52)) inst163 (.result(\3P ));
  LPM_CONSTANT #(.LPM_CVALUE(52'b1111111111111111111111111111111111111111111111110000), .LPM_WIDTH(52)) inst164 (.result(\4P ));
  LPM_CONSTANT #(.LPM_CVALUE(52'b1111111111111111111111111111111111111111111111100000), .LPM_WIDTH(52)) inst165 (.result(\5P ));
  LPM_CONSTANT #(.LPM_CVALUE(52'b1111111111111111111111111111111111111111111111000000), .LPM_WIDTH(52)) inst166 (.result(\6P ));
  LPM_CONSTANT #(.LPM_CVALUE(52'b1111111111111111111111111111111111111111111110000000), .LPM_WIDTH(52)) inst167 (.result(\7P ));
  LPM_CONSTANT #(.LPM_CVALUE(52'b1111111111111111111111111111111111111111111100000000), .LPM_WIDTH(52)) inst168 (.result(\8P ));
  LPM_CONSTANT #(.LPM_CVALUE(52'b1111111111111111111111111111111111111111111000000000), .LPM_WIDTH(52)) inst169 (.result(\9P ));
  LPM_MUX #(.LPM_SIZE(52), .LPM_WIDTH(6), .LPM_WIDTHS("CEIL(LOG2(LPM_SIZE))")) inst118 (
    .data({Q51, Q50, Q49, Q48, Q47, Q46, Q45, Q44, Q43, Q42, Q41, Q40, Q39, Q38, Q37, Q36, Q35, Q34, Q33, Q32, Q31, Q30, Q29, Q28, Q27, Q26, Q25, Q24, Q23, Q22, Q21, Q20, Q19, Q18, Q17, Q16, Q15, Q14, Q13, Q12, Q11, Q10, Q9, Q8, Q7, Q6, Q5, Q4, Q3, Q2, Q1, Q0}),
    .sel(ADDR), .result(VALUE));
  LPM_MUX #(.LPM_SIZE(52), .LPM_WIDTH(52), .LPM_WIDTHS("CEIL(LOG2(LPM_SIZE))")) inst125 (
    .data({\51P , \50P , \49P , \48P , \47P , \46P , \45P , \44P , \43P , \42P , \41P , \40P , \39P , \38P , \37P , \36P , \35P , \34P , \33P , \32P , \31P , \30P , \29P , \28P , \27P , \26P , \25P , \24P , \23P , \22P , \21P , \20P , \19P , \18P , \17P , \16P , \15P , \14P , \13P , \12P , \11P , \10P , \9P , \8P , \7P , \6P , \5P , \4P , \3P , \2P , \1P , \0P }),
    .sel(ADDR), .result(P_EN));
  LPM_CONSTANT #(.LPM_CVALUE(52'b1111111111111111111111111111111111111111110000000000), .LPM_WIDTH(52)) inst170 (.result(\10P ));
  LPM_CONSTANT #(.LPM_CVALUE(52'b1111111111111111111111111111111111111111100000000000), .LPM_WIDTH(52)) inst171 (.result(\11P ));
  LPM_CONSTANT #(.LPM_CVALUE(52'b1111111111111111111111111111111111111111000000000000), .LPM_WIDTH(52)) inst172 (.result(\12P ));
  LPM_CONSTANT #(.LPM_CVALUE(52'b1111111111111111111111111111111111111110000000000000), .LPM_WIDTH(52)) inst173 (.result(\13P ));
  LPM_CONSTANT #(.LPM_CVALUE(52'b1111111111111111111111111111111111111100000000000000), .LPM_WIDTH(52)) inst174 (.result(\14P ));
  LPM_CONSTANT #(.LPM_CVALUE(52'b1111111111111111111111111111111111111000000000000000), .LPM_WIDTH(52)) inst175 (.result(\15P ));
  LPM_CONSTANT #(.LPM_CVALUE(52'b1111111111111111111111111111111111110000000000000000), .LPM_WIDTH(52)) inst176 (.result(\16P ));
  LPM_CONSTANT #(.LPM_CVALUE(52'b1111111111111111111111111111111111100000000000000000), .LPM_WIDTH(52)) inst177 (.result(\17P ));
  LPM_CONSTANT #(.LPM_CVALUE(52'b1111111111111111111111111111111111000000000000000000), .LPM_WIDTH(52)) inst178 (.result(\18P ));
  LPM_CONSTANT #(.LPM_CVALUE(52'b1111111111111111111111111111111110000000000000000000), .LPM_WIDTH(52)) inst179 (.result(\19P ));
  LPM_CONSTANT #(.LPM_CVALUE(52'b1111111111111111111111111111111100000000000000000000), .LPM_WIDTH(52)) inst180 (.result(\20P ));
  LPM_CONSTANT #(.LPM_CVALUE(52'b1111111111111111111111111111111000000000000000000000), .LPM_WIDTH(52)) inst181 (.result(\21P ));
  LPM_CONSTANT #(.LPM_CVALUE(52'b1111111111111111111111111111110000000000000000000000), .LPM_WIDTH(52)) inst182 (.result(\22P ));
  LPM_CONSTANT #(.LPM_CVALUE(52'b1111111111111111111111111111100000000000000000000000), .LPM_WIDTH(52)) inst183 (.result(\23P ));
  LPM_CONSTANT #(.LPM_CVALUE(52'b1111111111111111111111111111000000000000000000000000), .LPM_WIDTH(52)) inst184 (.result(\24P ));
  LPM_CONSTANT #(.LPM_CVALUE(52'b1111111111111111111111111110000000000000000000000000), .LPM_WIDTH(52)) inst185 (.result(\25P ));
  LPM_CONSTANT #(.LPM_CVALUE(52'b1111111111111111111111111100000000000000000000000000), .LPM_WIDTH(52)) inst186 (.result(\26P ));
  LPM_CONSTANT #(.LPM_CVALUE(52'b1111111111111111111111111000000000000000000000000000), .LPM_WIDTH(52)) inst187 (.result(\27P ));
  LPM_CONSTANT #(.LPM_CVALUE(52'b1111111111111111111111110000000000000000000000000000), .LPM_WIDTH(52)) inst188 (.result(\28P ));
  LPM_CONSTANT #(.LPM_CVALUE(52'b1111111111111111111111100000000000000000000000000000), .LPM_WIDTH(52)) inst189 (.result(\29P ));
  LPM_CONSTANT #(.LPM_CVALUE(52'b1111111111111111111111000000000000000000000000000000), .LPM_WIDTH(52)) inst190 (.result(\30P ));
  LPM_CONSTANT #(.LPM_CVALUE(52'b1111111111111111111110000000000000000000000000000000), .LPM_WIDTH(52)) inst191 (.result(\31P ));
  LPM_CONSTANT #(.LPM_CVALUE(52'b1111111111111111111100000000000000000000000000000000), .LPM_WIDTH(52)) inst192 (.result(\32P ));
  LPM_CONSTANT #(.LPM_CVALUE(52'b1111111111111111111000000000000000000000000000000000), .LPM_WIDTH(52)) inst193 (.result(\33P ));
  LPM_CONSTANT #(.LPM_CVALUE(52'b1111111111111111110000000000000000000000000000000000), .LPM_WIDTH(52)) inst194 (.result(\34P ));
  LPM_CONSTANT #(.LPM_CVALUE(52'b1111111111111111100000000000000000000000000000000000), .LPM_WIDTH(52)) inst195 (.result(\35P ));
  LPM_CONSTANT #(.LPM_CVALUE(52'b1111111111111111000000000000000000000000000000000000), .LPM_WIDTH(52)) inst196 (.result(\36P ));
  LPM_CONSTANT #(.LPM_CVALUE(52'b1111111111111110000000000000000000000000000000000000), .LPM_WIDTH(52)) inst197 (.result(\37P ));
  LPM_CONSTANT #(.LPM_CVALUE(52'b1111111111111100000000000000000000000000000000000000), .LPM_WIDTH(52)) inst198 (.result(\38P ));
  LPM_CONSTANT #(.LPM_CVALUE(52'b1111111111111000000000000000000000000000000000000000), .LPM_WIDTH(52)) inst199 (.result(\39P ));
  LPM_CONSTANT #(.LPM_CVALUE(52'b1111111111110000000000000000000000000000000000000000), .LPM_WIDTH(52)) inst200 (.result(\40P ));
  LPM_CONSTANT #(.LPM_CVALUE(52'b1111111111100000000000000000000000000000000000000000), .LPM_WIDTH(52)) inst201 (.result(\41P ));
  LPM_CONSTANT #(.LPM_CVALUE(52'b1111111111000000000000000000000000000000000000000000), .LPM_WIDTH(52)) inst202 (.result(\42P ));
  LPM_CONSTANT #(.LPM_CVALUE(52'b1111111110000000000000000000000000000000000000000000), .LPM_WIDTH(52)) inst203 (.result(\43P ));
  LPM_CONSTANT #(.LPM_CVALUE(52'b1111111100000000000000000000000000000000000000000000), .LPM_WIDTH(52)) inst204 (.result(\44P ));
  LPM_CONSTANT #(.LPM_CVALUE(52'b1111111000000000000000000000000000000000000000000000), .LPM_WIDTH(52)) inst205 (.result(\45P ));
  LPM_CONSTANT #(.LPM_CVALUE(52'b1111110000000000000000000000000000000000000000000000), .LPM_WIDTH(52)) inst206 (.result(\46P ));
  LPM_CONSTANT #(.LPM_CVALUE(52'b1111100000000000000000000000000000000000000000000000), .LPM_WIDTH(52)) inst207 (.result(\47P ));
  LPM_CONSTANT #(.LPM_CVALUE(52'b1111000000000000000000000000000000000000000000000000), .LPM_WIDTH(52)) inst208 (.result(\48P ));
  LPM_CONSTANT #(.LPM_CVALUE(52'b1110000000000000000000000000000000000000000000000000), .LPM_WIDTH(52)) inst209 (.result(\49P ));
  LPM_CONSTANT #(.LPM_CVALUE(52'b1100000000000000000000000000000000000000000000000000), .LPM_WIDTH(52)) inst210 (.result(\50P ));
  LPM_CONSTANT #(.LPM_CVALUE(52'b1000000000000000000000000000000000000000000000000000), .LPM_WIDTH(52)) inst211 (.result(\51P ));
endmodule
